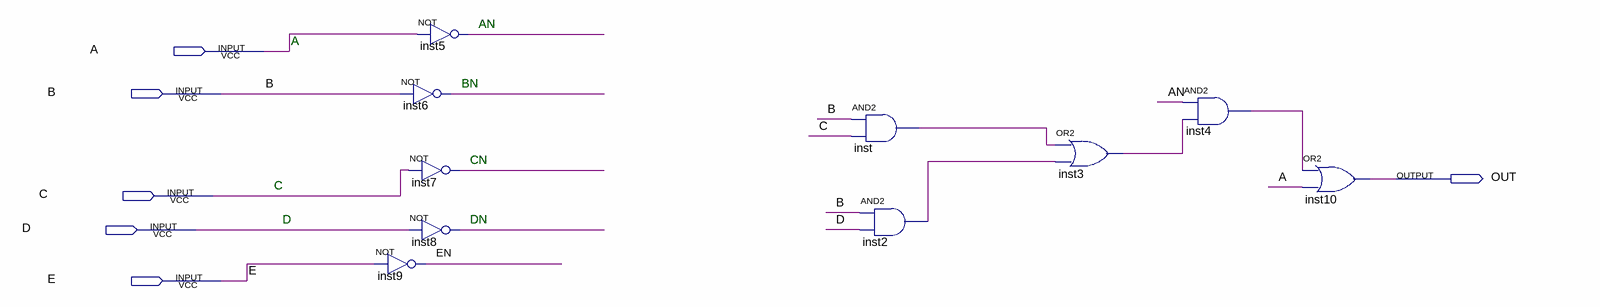
[diagram p0: schematic sheet]
// Quartus schematic 10CHECKER.bdf as structural Verilog: 10 symbols, 6 pins
module \10CHECKER  (
  input  A,
  input  B,
  input  C,
  input  D,
  input  E,
  output OUT
);

  wire AN, BN, CN, DN, EN, inst2_out, inst3_out, inst4_out, inst_out;

  not inst5 (AN, A);
  not inst6 (BN, B);
  not inst7 (CN, C);
  not inst8 (DN, D);
  not inst9 (EN, E);
  and inst (inst_out, B, C);
  and inst2 (inst2_out, B, D);
  or inst3 (inst3_out, inst_out, inst2_out);
  and inst4 (inst4_out, AN, inst3_out);
  or inst10 (OUT, inst4_out, A);

  // Notes on the sheet:
  //   AN
  //   A
  //   BN
  //   CN
  //   C
  //   D
  //   DN
endmodule
